# EAGLE design line_follower (EAGLE 7.7.0)
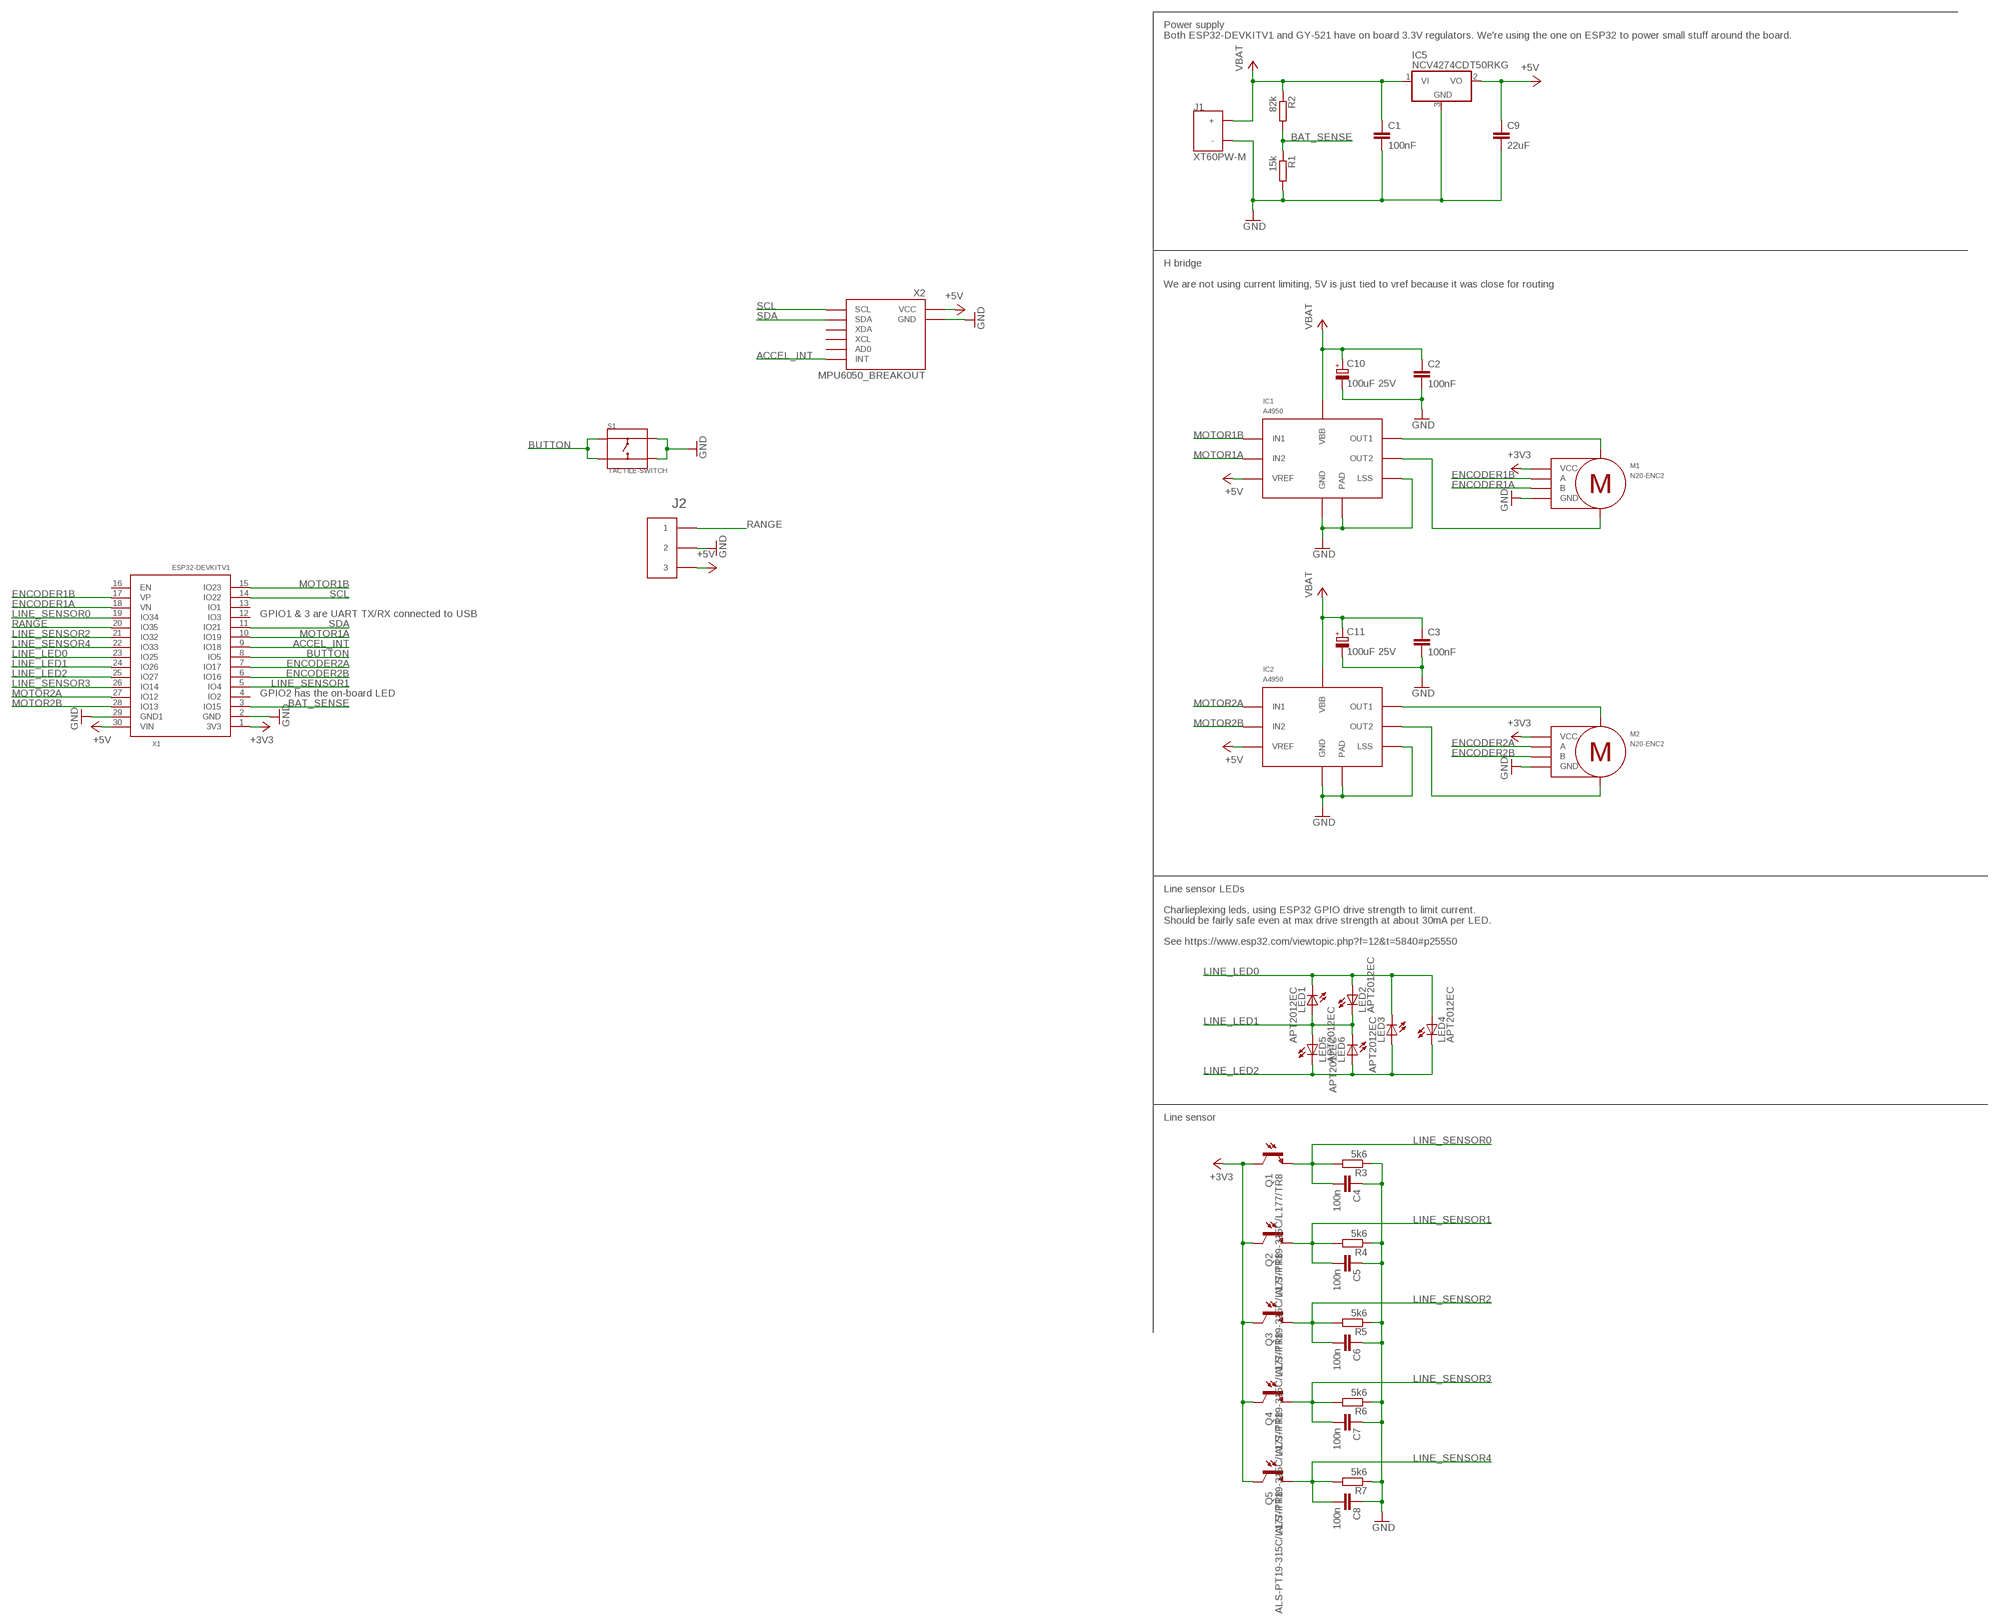
[diagram p0: schematic, sheet 1]

## Parts
C1  100nF  C-EUC0805  [C0805]
C2  100nF  C-EUC0805  [C0805]
C3  100nF  C-EUC0805  [C0805]
C4  100n  C-EUC0805  [C0805]
C5  100n  C-EUC0805  [C0805]
C6  100n  C-EUC0805  [C0805]
C7  100n  C-EUC0805  [C0805]
C8  100n  C-EUC0805  [C0805]
C9  22uF  C-EUC0805  [C0805]
C10  100uF 25V  CPOL-EUUD-6,3X8,8  [UD-6,3X5,8_NICHICON]
C11  100uF 25V  CPOL-EUUD-6,3X8,8  [UD-6,3X5,8_NICHICON]
IC1  A4950  [SOIC8_PAD]
IC2  A4950  [SOIC8_PAD]
IC5  NCV4274CDT50RKG  7805DT  [TO252]
J1  XT60PW-M  [XT60PW-M]
J2  2.54MM_HEADER_3X1  [2.54MM_HEADER_3X1]
LED1  APT2012EC  LEDCHIP-LED0805  [CHIP-LED0805]
LED2  APT2012EC  LEDCHIP-LED0805  [CHIP-LED0805]
LED3  APT2012EC  LEDCHIP-LED0805  [CHIP-LED0805]
LED4  APT2012EC  LEDCHIP-LED0805  [CHIP-LED0805]
LED5  APT2012EC  LEDCHIP-LED0805  [CHIP-LED0805]
LED6  APT2012EC  LEDCHIP-LED0805  [CHIP-LED0805]
M1  N20-ENC2  [2.54MM_HEADER_6X1]
M2  N20-ENC2  [2.54MM_HEADER_6X1]
Q1  ALS-PT19-315C/L177/TR8  [PHOTOTRANSISTOR-1.7MM]
Q2  ALS-PT19-315C/L177/TR8  [PHOTOTRANSISTOR-1.7MM]
Q3  ALS-PT19-315C/L177/TR8  [PHOTOTRANSISTOR-1.7MM]
Q4  ALS-PT19-315C/L177/TR8  [PHOTOTRANSISTOR-1.7MM]
Q5  ALS-PT19-315C/L177/TR8  [PHOTOTRANSISTOR-1.7MM]
R1  15k  R-EU_R0805  [R0805]
R2  82k  R-EU_R0805  [R0805]
R3  5k6  R-EU_R0805  [R0805]
R4  5k6  R-EU_R0805  [R0805]
R5  5k6  R-EU_R0805  [R0805]
R6  5k6  R-EU_R0805  [R0805]
R7  5k6  R-EU_R0805  [R0805]
S1  TACTILE-SWITCH  [SW4-SMD-4.5MM]
X1  ESP32DEVKITV1  [ESP32-DEVKITV1]
X2  MPU6050_BREAKOUT  [MPU6050_BREAKOUT]

## Nets
+3V3: M1.P$5(VCC) M2.P$5(VCC) Q1.C Q2.C Q3.C Q4.C Q5.C X1.1(3V3)
+5V: C9.1 IC1.4(VREF) IC2.4(VREF) IC5.2(VO) J2.P$3 X1.30(VIN) X2.P$1(VCC)
ACCEL_INT: X1.9(IO18) X2.P$8(INT)
BAT_SENSE: R1.1 R2.2 X1.3(IO15)
BUTTON: S1.P$1(A0) S1.P$3(B0) X1.8(IO5)
ENCODER1A: M1.P$4(B) X1.18(VN)
ENCODER1B: M1.P$3(A) X1.17(VP)
ENCODER2A: M2.P$3(A) X1.7(IO17)
ENCODER2B: M2.P$4(B) X1.6(IO16)
GND: C1.2 C2.2 C3.2 C4.1 C5.1 C6.1 C7.1 C8.1 C9.2 C10.- C11.- IC1.1(GND) IC1.7(LSS) IC1.PAD IC2.1(GND) IC2.7(LSS) IC2.PAD IC5.3(GND) J1.NEG(-) J2.P$2 M1.P$2(GND) M2.P$2(GND) R1.2 R3.1 R4.1 R5.1 R6.1 R7.1 S1.P$2(A1) S1.P$4(B1) X1.2(GND) X1.29(GND1) X2.P$2(GND)
LINE_LED0: LED1.C LED2.A LED3.C LED4.A X1.23(IO25)
LINE_LED1: LED1.A LED2.C LED5.A LED6.C X1.24(IO26)
LINE_LED2: LED3.A LED4.C LED5.C LED6.A X1.25(IO27)
LINE_SENSOR0: C4.2 Q1.E R3.2 X1.19(IO34)
LINE_SENSOR1: C5.2 Q2.E R4.2 X1.5(IO4)
LINE_SENSOR2: C6.2 Q3.E R5.2 X1.21(IO32)
LINE_SENSOR3: C7.2 Q4.E R6.2 X1.26(IO14)
LINE_SENSOR4: C8.2 Q5.E R7.2 X1.22(IO33)
MOTOR1A: IC1.2(IN2) X1.10(IO19)
MOTOR1B: IC1.3(IN1) X1.15(IO23)
MOTOR2A: IC2.3(IN1) X1.27(IO12)
MOTOR2B: IC2.2(IN2) X1.28(IO13)
N$1: IC2.6(OUT1) M2.P$1(M+)
N$2: IC1.6(OUT1) M1.P$1(M+)
N$3: IC1.8(OUT2) M1.P$6(M-)
N$4: IC2.8(OUT2) M2.P$6(M-)
RANGE: J2.P$1 X1.20(IO35)
SCL: X1.14(IO22) X2.P$3(SCL)
SDA: X1.11(IO21) X2.P$4(SDA)
VBAT: C1.1 C2.1 C3.1 C10.+ C11.+ IC1.5(VBB) IC2.5(VBB) IC5.1(VI) J1.POS(+) R2.1
Unconnected: X1.4(IO2) X1.12(IO3) X1.13(IO1) X1.16(EN) X2.P$5(XCL) X2.P$6(XDA) X2.P$7(AD0)

## Notes on the sheet
- Power supply
  Both ESP32-DEVKITV1 and GY-521 have on board 3.3V regulators. We're using the one on ESP32 to power small stuff around the board.
- H bridge
  
  We are not using current limiting, 5V is just tied to vref because it was close for routing
- GPIO1 & 3 are UART TX/RX connected to USB
- GPIO2 has the on-board LED
- Line sensor LEDs
  
  Charlieplexing leds, using ESP32 GPIO drive strength to limit current.
  Should be fairly safe even at max drive strength at about 30mA per LED.
  
  See https://www.esp32.com/viewtopic.php?f=12&t=5840#p25550
- Line sensor

## Library data of the parts
C1-C9 = rcl:C-EU: CAPACITOR, European symbol
C10 C11 = rcl:CPOL-EU: POLARIZED CAPACITOR, European symbol
IC1 IC2 = untitled:A4950
IC5 = linear:78*: Positive VOLTAGE REGULATOR Source: http://cache.national.com/ds/LM/LM78L05.pdf http://www.fairchildsemi.com/ds/LM/LM7805.pdf
J1 = untitled:XT60PW-M
J2 = untitled:2.54MM_HEADER_3X1
LED1-LED6 = led:LED: LED OSRAM: - CHIPLED LG R971, LG N971, LY N971, LG Q971, LY Q971, LO R971, LY R971 LH N974, LH R974 LS Q976, LO Q976, LY Q976 LO Q996 - Hyper CHIPLED LW Q18S LB Q993, LB Q99A, LB R99A - SideLED LS A670, LO A670, LY A670, LG A670, LP A670 LB A673, LV A673, LT A673, LW A673 LH A674 LY A675 LS A676, LA A676, LO A676, LY A676, LW A676 LS A679, LY A679, LG A679 - Hyper Micro SIDELED® LS Y876, LA Y876, LO Y876, LY Y876 LT Y87S - SmartLED LW L88C, LW L88S LB L89C, LB L89S, LG L890 LS L89K, LO L89K, LY L89K LS L896, LA L896, LO L896, LY L896 - TOPLED LS T670, LO T670, LY T670, LG T670, LP T670 LSG T670, LSP T670, LSY T670, LOP T670, LYG T670 LG T671, LOG T671, LSG T671 LB T673, LV T673, LT T673, LW T673 LH T674 LS T676, LA T676, LO T676, LY T676, LB T676, LH T676, LSB T676, LW T676 LB T67C, LV T67C, LT T67C, LS T67K, LO T67K, LY T67K, LW E67C LS E67B, LA E67B, LO E67B, LY E67B, LB E67C, LV E67C, LT E67C LW T67C LS T679, LY T679, LG T679 LS T770, LO T770, LY T770, LG T770, LP T770 LB T773, LV T773, LT T773, LW T773 LH T774 LS E675, LA E675, LY E675, LS T675 LS T776, LA T776, LO T776, LY T776, LB T776 LHGB T686 LT T68C, LB T68C - Hyper Mini TOPLED® LB M676 - Mini TOPLED Santana® LG M470 LS M47K, LO M47K, LY M47K Source: http://www.osram.convergy.de LUXEON: - LUMILED® LXK2-PW12-R00, LXK2-PW12-S00, LXK2-PW14-U00, LXK2-PW14-V00 LXK2-PM12-R00, LXK2-PM12-S00, LXK2-PM14-U00 LXK2-PE12-Q00, LXK2-PE12-R00, LXK2-PE12-S00, LXK2-PE14-T00, LXK2-PE14-U00 LXK2-PB12-K00, LXK2-PB12-L00, LXK2-PB12-M00, LXK2-PB14-N00, LXK2-PB14-P00, LXK2-PB14-Q00 LXK2-PR12-L00, LXK2-PR12-M00, LXK2-PR14-Q00, LXK2-PR14-R00 LXK2-PD12-Q00, LXK2-PD12-R00, LXK2-PD12-S00 LXK2-PH12-R00, LXK2-PH12-S00 LXK2-PL12-P00, LXK2-PL12-Q00, LXK2-PL12-R00 Source: www.luxeon.com KINGBRIGHT: KA-3528ASYC Source: www.kingbright.com
M1 M2 = untitled:N20-ENC2
Q1-Q5 = untitled:ALS-PT19-315C/L177/TR8
R1-R7 = rcl:R-EU_: RESISTOR, European symbol
S1 = cube:TACTILE-SWITCH
X1 = ESP32-DEVKITV1:ESP32DEVKITV1
X2 = untitled:MPU6050_BREAKOUT

## Board
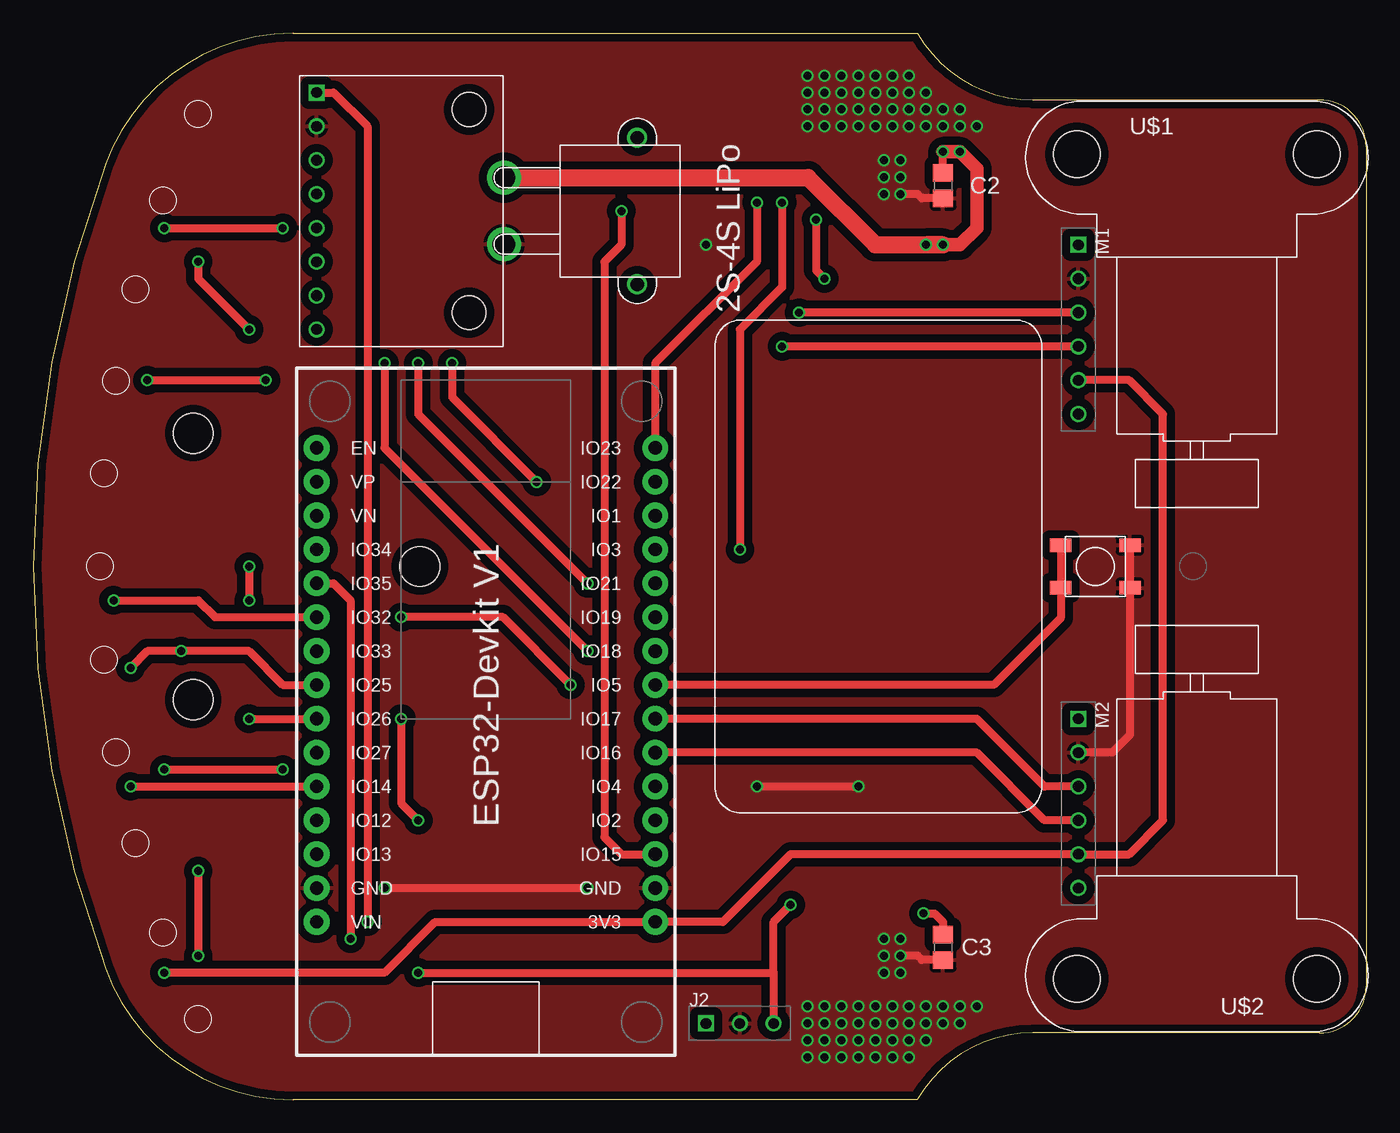
[diagram p1: board, top side]
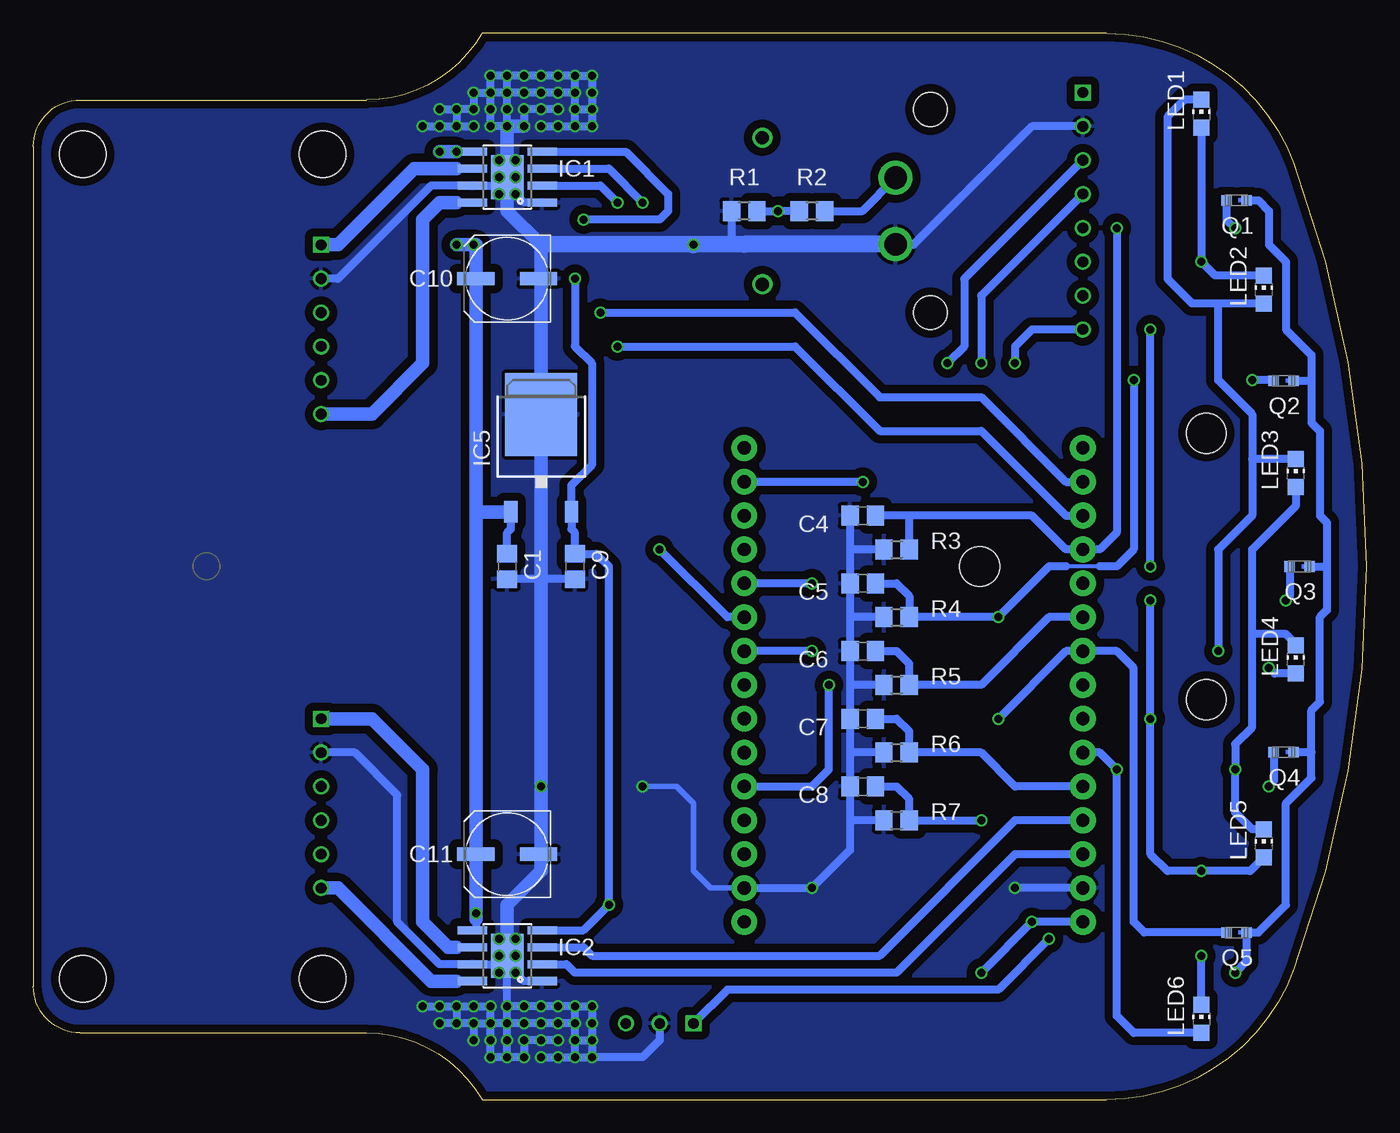
[diagram p2: board, bottom side, seen from below]

Size 100 x 80 mm. Coordinates in mm from the lower left corner, seen from the top.
Outline: 5.41,70.21 arc41 5.41,9.79 arc70 19.48,0 66.34,0 arc-60 75,5 96.5,5 arc90 100,8.5 100,71.5 arc90 96.5,75 75,75 arc-60 66.34,80 19.48,80 arc70 5.41,70.21
Copper layers (1*16): Top 0.035559375mm / dielectric 1.6mm / Bottom 0.035559375mm
Design rules "jlcpcb2layer": minimum track width 5mil, minimum drill 12mil, track to track 5mil, track to pad 5mil, pad to pad 5mil, via to via 5mil, smd to smd 5mil, copper to edge 8mil, drill to drill 6mil, minimum pad ring 5mil, minimum via ring 3mil, stop-mask expansion 2.5mil, vias tented up to drill 0mil, thermal gap 10mil
Holes 3 mm at 12,50 12,30 29,40

### Footprints (pad centres in the part's own frame; a part is rotated, then mirrored left to right if it is on the bottom)
C0805 = smd 1.3 x 1.5: 1 -0.95,0; 2 0.95,0
UD-6,3X5,8_NICHICON = smd 2.8 x 1: + 2.35,0; - -2.35,0
SOIC8_PAD = smd 0.61 x 2.21: 1 -1.905,-2.616; 2 -0.635,-2.616; 3 0.635,-2.616; 4 1.905,-2.616; 5 1.905,2.616; 6 0.635,2.616; 7 -0.635,2.616; 8 -1.905,2.616 | smd 3.3 x 2.41: PAD 0,0
TO252 = smd 1 x 1.6: 1 -2.28,-4.8; 2 2.28,-4.8 | smd 5.4 x 6.2: 3 0,2.5
XT60PW-M = drill 1: NC1 -5.5,5; NC2 5.5,5 | drill 1.7: NEG 2.5,-5; POS -2.5,-5
2.54MM_HEADER_3X1 = drill 0.8 square: P$1 -2.54,0 | drill 0.8: P$2 0,0; P$3 2.54,0
CHIP-LED0805 = smd 1.2 x 1.2: A 0,-1.05; C 0,1.05
2.54MM_HEADER_6X1 = drill 0.8 square: P$1 -6.35,0 | drill 0.8: P$2 -3.81,0; P$3 -1.27,0; P$4 1.27,0; P$5 3.81,0; P$6 6.35,0
PHOTOTRANSISTOR-1.7MM = smd 0.8 x 0.8: C -0.75,0; E 0.75,0
R0805 = smd 1.3 x 1.5: 1 -0.95,0; 2 0.95,0
SW4-SMD-4.5MM = smd 1.6 x 1: P$1 -2.6,1.6; P$2 2.6,1.6; P$3 -2.6,-1.6; P$4 2.6,-1.6
N20-ENC-NOPIN = hole 3.5: -9,-4; 9,-4
ESP32-DEVKITV1 = drill 1 pad 1.93: 1 -17.78,-12.7; 2 -15.24,-12.7; 3 -12.7,-12.7; 4 -10.16,-12.7; 5 -7.62,-12.7; 6 -5.08,-12.7; 7 -2.54,-12.7; 8 0,-12.7; 9 2.54,-12.7; 10 5.08,-12.7; 11 7.62,-12.7; 12 10.16,-12.7; 13 12.7,-12.7; 14 15.24,-12.7; 15 17.78,-12.7; 16 17.78,12.7; 17 15.24,12.7; 18 12.7,12.7; 19 10.16,12.7; 20 7.62,12.7; 21 5.08,12.7; 22 2.54,12.7; 23 0,12.7; 24 -2.54,12.7; 25 -5.08,12.7; 26 -7.62,12.7; 27 -10.16,12.7; 28 -12.7,12.7; 29 -15.24,12.7; 30 -17.78,12.7
MPU6050_BREAKOUT = drill 0.8 square: P$1 -6.35,8.89 | drill 0.8: P$2 -6.35,6.35; P$3 -6.35,3.81; P$4 -6.35,1.27; P$5 -6.35,-1.27; P$6 -6.35,-3.81; P$7 -6.35,-6.35; P$8 -6.35,-8.89 | hole 2.54: 5.08,7.62; 5.08,-7.62

### Placement (x,y rotation side)
C1  64.44,40 270 bottom
C2  68.25,68.58 270 top
C3  68.25,11.43 270 top
C4  37.77,43.81 0 bottom
C5  37.77,38.73 0 bottom
C6  37.77,33.65 0 bottom
C7  37.77,28.57 0 bottom
C8  37.77,23.49 0 bottom
C9  59.36,40 270 bottom
C10  64.44,61.59 180 bottom
C11  64.44,18.41 180 bottom
IC1  64.44,69.21 90 bottom
IC2  64.44,10.79 90 bottom
IC5  61.9,48.89 0 bottom
J1  40.31,66.67 270 top
J2  53.01,5.71 0 top
LED1  12.36,73.96 0 bottom
LED2  7.68,60.78 0 bottom
LED3  5.3,46.99 0 bottom
LED4  5.3,33.01 0 bottom
LED5  7.68,19.22 0 bottom
LED6  12.36,6.04 0 bottom
M1  78.41,57.78 270 top
M2  78.41,22.22 270 top
Q1  9.74,67.47 180 bottom
Q2  6.19,53.94 180 bottom
Q3  5,40 180 bottom
Q4  6.19,26.06 180 bottom
Q5  9.74,12.53 180 bottom
R1  46.66,66.67 180 bottom
R2  41.58,66.67 180 bottom
R3  35.23,41.27 0 bottom
R4  35.23,36.19 0 bottom
R5  35.23,31.11 0 bottom
R6  35.23,26.03 0 bottom
R7  35.23,20.95 0 bottom
S1  79.68,40 0 top
U$1  [N20-ENC-NOPIN]  87.3,74.93 0 top
U$2  [N20-ENC-NOPIN]  87.3,5.08 180 top
X1  33.96,31.11 90 top
X2  27.61,66.67 0 top

### Tracks (layer width: path | path; a pad name or v marks a point on that pad's centre or on a via)
+3V3  (via drill 0.6)
  Top 0.61: M1.P$5 82.22,53.97 84.76,51.43 84.76,20.95 82.22,18.41 M2.P$5 56.82,18.41 51.74,13.33 X1.1 30.15,13.33 26.34,9.52 v9.83,9.52
  Bottom 0.61: Q1.C 8.09,67.47 7.29,66.67 7.29,64.13 6.02,62.86 6.02,57.78 4.11,55.87 4.11,53.94 | Q4.C 4.11,26.06 | Q3.C 2.95,40 | Q2.C 4.11,53.94 | v9.83,9.52 8.99,10.36 Q5.C 8.09,12.53 6.02,14.6 6.02,22.22 4.11,24.13 4.11,26.06 | 4.11,26.06 4.11,29.21 3.48,29.84 3.48,36.19 2.95,36.72 2.95,40 | 4.11,53.94 4.11,50.79 3.48,50.16 3.48,43.81 2.95,43.28 2.95,40
+5V  (via drill 0.6)
  Top 0.61: X2.P$1 22.53,75.56 25.07,73.02 v25.07,13.33 | v58.72,66.04 58.72,62.23 v59.36,61.59 | v28.88,9.52 55.55,9.52 | 55.55,9.52 J2.P$3 | 55.55,9.52 55.55,13.33 v56.82,14.6
  Bottom 0.61: 59.62,41.21 C9.1 | C9.1 59.36,42.54 59.62,42.8 IC5.2 59.62,46.09 58.09,47.62 58.09,55.24 59.36,56.51 v59.36,61.59 | IC1.4 55.55,71.12 52.37,67.94 52.37,66.67 53.01,66.04 v58.72,66.04 | C9.1 57.77,40.95 56.82,40 v56.82,14.6 58.72,12.7 IC2.4 | v28.88,9.52 v25.07,13.33 X1.30
ACCEL_INT  (via drill 0.6)
  Top 0.61: v26.34,55.24 26.34,48.89 v41.58,33.65
  Bottom 0.61: X2.P$8 25.07,57.78 26.34,56.51 v26.34,55.24 | v41.58,33.65 X1.9
BAT_SENSE  (via drill 0.6)
  Top 0.61: v44.12,66.67 44.12,64.13 42.85,62.86 42.85,19.68 44.12,18.41 X1.3
  Bottom 0.61: R2.2 v44.12,66.67 R1.1
BUTTON
  Top 0.61: S1.P$1 S1.P$3 77.08,36.13 72.06,31.11 X1.8
ENCODER1A  (via drill 0.6)
  Top 0.61: M1.P$4 v56.18,56.51
  Bottom 0.61: v56.18,56.51 42.85,56.51 36.5,50.16 28.88,50.16 22.53,43.81 X1.18
ENCODER1B  (via drill 0.6)
  Top 0.61: M1.P$3 v57.45,59.05
  Bottom 0.61: v57.45,59.05 42.85,59.05 36.5,52.7 28.88,52.7 22.53,46.35 X1.17
ENCODER2A
  Top 0.61: M2.P$3 75.87,23.49 70.79,28.57 X1.7
ENCODER2B
  Top 0.61: M2.P$4 75.87,20.95 70.79,26.03 X1.6
GND  (via drill 0.6)
  Top 0.61: S1.P$2 S1.P$4 82.28,27.36 80.95,26.03 M2.P$2 | C2.2 66.66,67.63 66.34,67.94 v65.07,67.94 | C3.2 66.66,10.48 66.34,10.79 v65.07,10.79 | v54.28,23.49 v61.9,23.49 | v26.34,15.87 v41.58,15.87
  Bottom 0.406: X1.2 49.2,15.87 50.47,17.14 50.47,22.22 51.74,23.49 v54.28,23.49
  Bottom 0.61: 64.44,69.85 63.8,69.85 v63.8,70.48 | 65.07,68.58 v65.07,67.94 64.44,67.94 v63.8,67.94 63.17,67.31 IC1.1 | 65.07,68.58 v65.07,69.21 | v65.07,9.52 v65.07,10.79 65.07,10.16 | v61.9,73.02 v60.63,73.02 v59.36,73.02 | v59.36,73.02 v59.36,74.29 | v59.36,74.29 v59.36,75.56 | v59.36,75.56 v60.63,75.56 v61.9,75.56 v63.17,75.56 v64.44,75.56 | v64.44,75.56 v64.44,74.29 v64.44,73.02 v65.71,73.02 v65.71,74.29 v65.71,75.56 | v63.17,73.02 v63.17,74.29 v61.9,74.29 v60.63,74.29 | 65.07,10.16 64.44,9.52 v64.44,6.98 | IC2.1 63.17,8.89 v63.8,9.52 | IC2.7 69.52,10.16 72.69,13.33 72.69,22.86 75.87,26.03 M2.P$2 | 65.07,68.58 IC1.7 70.15,68.58 77.14,61.59 M1.P$2 | IC2.PAD 63.8,11.43 v63.8,12.06 64.44,12.06 64.76,12.06 | v63.8,10.79 IC2.PAD | IC2.7 64.44,10.16 IC2.PAD | IC2.7 65.07,10.16 | v65.71,5.71 v65.71,6.98 v66.98,6.98 v68.25,6.98 | v70.79,6.98 v69.52,6.98 v68.25,6.98 | v66.98,5.71 v65.71,5.71 | v68.25,6.98 v68.25,5.71 | v66.98,5.71 v66.98,4.44 | v59.36,4.44 v58.09,4.44 | v58.09,4.44 v58.09,5.71 v58.09,6.98 v59.36,6.98 | v59.36,5.71 v59.36,6.98 | v59.36,6.98 v60.63,6.98 v61.9,6.98 v63.17,6.98 v64.44,6.98 | v64.44,5.71 v64.44,6.98 | v61.9,3.17 v60.63,3.17 v59.36,3.17 | v59.36,3.17 v59.36,4.44 | v59.36,4.44 v59.36,5.71 | v59.36,5.71 v60.63,5.71 v61.9,5.71 v63.17,5.71 v64.44,5.71 | v64.44,5.71 v64.44,4.44 v64.44,3.17 | v64.44,3.17 v63.17,3.17 v63.17,4.44 v61.9,4.44 v60.63,4.44 | v59.36,3.17 v58.09,3.17 | v58.09,4.44 v58.09,3.17 | v64.44,5.71 v65.71,5.71 | v65.71,5.71 v65.71,4.44 v65.71,3.17 v64.44,3.17 | v66.98,5.71 v69.52,5.71 | v59.36,74.29 v58.09,74.29 | v58.09,74.29 v58.09,75.56 v58.09,76.83 v59.36,76.83 | v59.36,73.02 v58.09,73.02 v58.09,74.29
  Bottom 0.61: v59.36,75.56 v59.36,76.83 | v59.36,76.83 v60.63,76.83 v61.9,76.83 v63.17,76.83 v64.44,76.83 | v64.44,75.56 v64.44,76.83 | v64.44,76.83 v65.71,76.83 v65.71,75.56 | v64.44,75.56 v65.71,75.56 | v70.79,73.02 v69.52,73.02 v68.25,73.02 | v68.25,73.02 v66.98,73.02 | v65.71,75.56 v66.98,75.56 v66.98,74.29 v68.25,74.29 | v69.52,74.29 v68.25,74.29 | v68.25,74.29 v68.25,73.02 | C9.2 61.9,39.05 C1.2 | 61.9,33.33 61.9,33.65 | R1.2 47.61,64.17 46.66,64.17 | X2.P$2 25.07,73.02 33.96,64.13 35.27,64.13 J1.NEG | X1.29 v26.34,15.87 | X1.2 v41.58,15.87 38.72,18.73 38.72,20.95 | C4.1 38.72,41.27 | 38.72,41.27 C5.1 38.72,36.19 | 38.72,36.19 C6.1 38.72,31.11 | 38.72,31.11 C7.1 38.72,26.03 | 38.72,26.03 C8.1 38.72,20.95 | R7.1 38.72,20.95 | J2.P$2 53.01,4.44 54.28,3.17 v58.09,3.17 | R3.1 38.72,41.27 | R4.1 38.72,36.19 | R5.1 38.72,31.11 | R6.1 38.72,26.03
  Bottom 1.016: 62.09,64.13 62.09,64.32 | 64.44,67.94 64.44,66.67 61.9,64.13 | 64.44,12.06 64.44,14.6 61.9,17.14 61.9,18.41 | v63.17,73.02 v64.44,73.02 64.44,70.48 | 61.9,64.17 62.05,64.17 62.09,64.13 | 61.9,18.41 v61.9,23.49 61.9,33.65 61.9,39.05 IC5.3 61.9,61.59 | 61.9,18.41 C11.- | 62.09,64.13 61.9,64.13 | 61.9,64.13 61.9,61.59 | 61.9,61.59 C10.-
  Bottom 1.27: J1.NEG 46.66,64.17 v50.47,64.13 61.9,64.17 61.9,64.13
  other vias: 65.07,70.48 65.07,12.06 63.8,69.21
  pour Bottom (isolate 0.61): -0.33,80.64 -0.33,0.63 100,-0.64 100,80.64
  pour Top (isolate 0.61): -0.33,80.64 -0.33,0.63 100,-0.64 100,80.64
LINE_LED0  (via drill 0.6)
  Top 0.61: X1.23 18.72,31.11 16.18,33.65 v11.1,33.65 8.56,33.65 v7.29,32.38
  Bottom 0.61: LED1.C 13.64,75.01 14.91,73.74 14.91,61.59 13.05,59.73 11.1,59.73 | LED2.A 11.1,59.73 | 11.1,59.73 11.1,53.97 8.56,51.43 8.56,48.04 | 8.56,48.04 8.56,43.81 11.1,41.27 v11.1,33.65 | LED3.C 8.56,48.04 | LED4.A 6.87,31.96 v7.29,32.38
LINE_LED1  (via drill 0.6)
  Top 0.61: v12.37,17.14 v12.37,10.79 | v16.18,28.57 X1.24 | v16.18,40 v16.18,37.46 | v12.37,62.86 12.37,61.59 v16.18,57.78
  Bottom 0.61: LED5.A 8.71,17.14 v12.37,17.14 14.91,17.14 16.18,18.41 v16.18,28.57 v16.18,37.46 | LED6.C 12.37,7.1 v12.37,10.79 | LED2.C 11.34,61.83 v12.37,62.86 v12.36,62.87 LED1.A | v16.18,40 v16.18,57.78
LINE_LED2  (via drill 0.6)
  Top 0.61: v9.83,24.76 v18.72,24.76
  Bottom 0.61: LED6.A 17.45,4.99 18.72,6.26 v18.72,24.76 19.99,26.03 X1.25 | LED5.C 8.56,20.27 9.83,21.54 v9.83,24.76 9.83,26.67 8.56,27.94 8.56,34.92 | 8.56,34.92 8.56,41.27 5.3,44.53 LED3.A | LED4.C 5.3,34.2 6.02,34.92 8.56,34.92
LINE_SENSOR0  (via drill 0.6)
  Top 0.61: v9.83,65.4 v18.72,65.4
  Bottom 0.61: Q1.E 10.49,66.01 v9.83,65.4 | v18.72,65.4 18.72,42.54 19.99,41.27 X1.19 22.53,41.27 25.07,43.81 34.28,43.81 | 34.28,43.81 C4.2 | R3.2 34.28,43.81
LINE_SENSOR1  (via drill 0.6)
  Top 0.61: v8.56,53.97 v17.45,53.97 | v40.31,31.11 35.23,36.19 v27.61,36.19
  Bottom 0.305: 19.99,40 22.53,40
  Bottom 0.61: v17.45,53.97 17.45,41.27 18.72,40 19.99,40 | 22.53,40 23.8,40 v27.61,36.19 R4.2 34.28,37.78 35.23,38.73 C5.2 | X1.5 41.58,23.49 40.31,24.76 v40.31,31.11 | Q2.E 6.98,53.97 v8.56,53.97
LINE_SENSOR2  (via drill 0.6)
  Top 0.61: v6.02,37.46 12.37,37.46 13.64,36.19 X1.21
  Bottom 0.61: Q3.E 5.75,37.73 v6.02,37.46 | X1.21 23.8,36.19 28.88,31.11 R5.2 34.28,32.7 35.23,33.65 C6.2
LINE_SENSOR3  (via drill 0.6)
  Top 0.61: v7.29,23.49 X1.26
  Bottom 0.61: Q4.E 6.94,23.84 v7.29,23.49 | X1.26 26.34,23.49 28.88,26.03 R6.2 34.28,27.62 35.23,28.57 C7.2
LINE_SENSOR4  (via drill 0.6)
  Top 0.61: v27.61,28.57 27.61,22.22 v28.88,20.95
  Bottom 0.61: v27.61,28.57 22.53,33.65 X1.22 18.72,33.65 17.45,32.38 17.45,13.33 16.65,12.53 Q5.E | v28.88,20.95 R7.2 34.28,22.54 35.23,23.49 C8.2
MOTOR1A  (via drill 0.6)
  Top 0.61: v56.18,67.31 56.18,60.96 53.01,57.78 v53.01,41.27
  Bottom 0.61: IC1.2 57.45,68.58 v56.18,67.31 | X1.10 47.93,36.19 v53.01,41.27
MOTOR1B  (via drill 0.6)
  Top 0.61: v54.28,67.31 54.28,62.86 46.66,55.24 X1.15
  Bottom 0.61: IC1.3 56.82,69.85 v54.28,67.31
MOTOR2A
  Bottom 0.61: X1.27 26.34,20.95 36.5,10.79 58.09,10.79 58.72,11.43 IC2.3
MOTOR2B
  Bottom 0.61: X1.28 26.34,18.41 35.23,9.52 59.36,9.52 59.99,10.16 IC2.2
N$1
  Bottom 0.61: IC2.6 68.25,11.43
  Bottom 1.016: M2.P$1 74.6,28.57 70.79,24.76 70.79,13.33 68.88,11.43 68.25,11.43
N$2
  Bottom 0.61: IC1.6 68.25,69.85
  Bottom 1.016: M1.P$1 77.14,64.13 71.42,69.85 68.25,69.85
N$3
  Bottom 0.61: IC1.8 68.25,67.31
  Bottom 1.016: M1.P$6 74.6,51.43 70.79,55.24 70.79,66.04 69.52,67.31 68.25,67.31
N$4
  Bottom 0.61: IC2.8 68.25,8.89
  Bottom 1.016: M2.P$6 77.14,15.87 70.15,8.89 68.25,8.89
RANGE  (via drill 0.6)
  Top 0.61: X1.20 22.53,38.73 23.8,37.46 v23.8,12.06
  Bottom 0.61: v23.8,12.06 27.61,8.25 47.93,8.25 J2.P$1
SCL  (via drill 0.6)
  Top 0.61: v31.42,55.24 31.42,52.7 v37.77,46.35
  Bottom 0.61: X2.P$3 30.15,61.59 30.15,56.51 v31.42,55.24 | v37.77,46.35 X1.14
SDA  (via drill 0.6)
  Top 0.61: v28.88,55.24 28.88,51.43 v41.58,38.73
  Bottom 0.61: X2.P$4 28.88,60.32 v28.88,55.24 | v41.58,38.73 X1.11
VBAT  (via drill 0.6)
  Top 0.61: C2.1 v68.25,71.12 | v66.79,13.97 67.61,13.97 68.25,13.33 C3.1
  Top 1.016: v68.25,71.12 v69.52,71.12 70.79,69.85 70.79,65.4 69.52,64.13 v66.98,64.13
  Top 1.27: J1.POS 58.13,69.17 63.17,64.13 v68.25,64.13 v66.98,64.13
  Bottom 0.61: 66.66,71.12 IC1.5 v68.25,71.12 | 66.79,12.7 IC2.5 | 66.66,19.68 C11.+ | C1.1 64.44,42.54 64.18,42.8 IC5.1 | 66.79,13.52 66.79,12.7 | 66.66,12.7 66.79,12.7 | 66.79,26.35 66.79,27.3 | R2.1 37.81,66.67 J1.POS
  Bottom 1.016: v68.25,71.12 v69.52,71.12 | 66.79,43.81 66.79,27.3 C11.+ v66.79,13.97 66.79,13.52 | 66.79,43.81 C10.+ 66.79,64.13 v68.25,64.13 | IC5.1 66.51,44.09 66.79,43.81

### Text on the board
tNames: 2S-4S LiPo
tDocu: https://github.com/bluecube/line_follower | Line follower v2.0
bDocu: May 2020